# EAGLE design sensor_v60 (EAGLE 7.7.0)
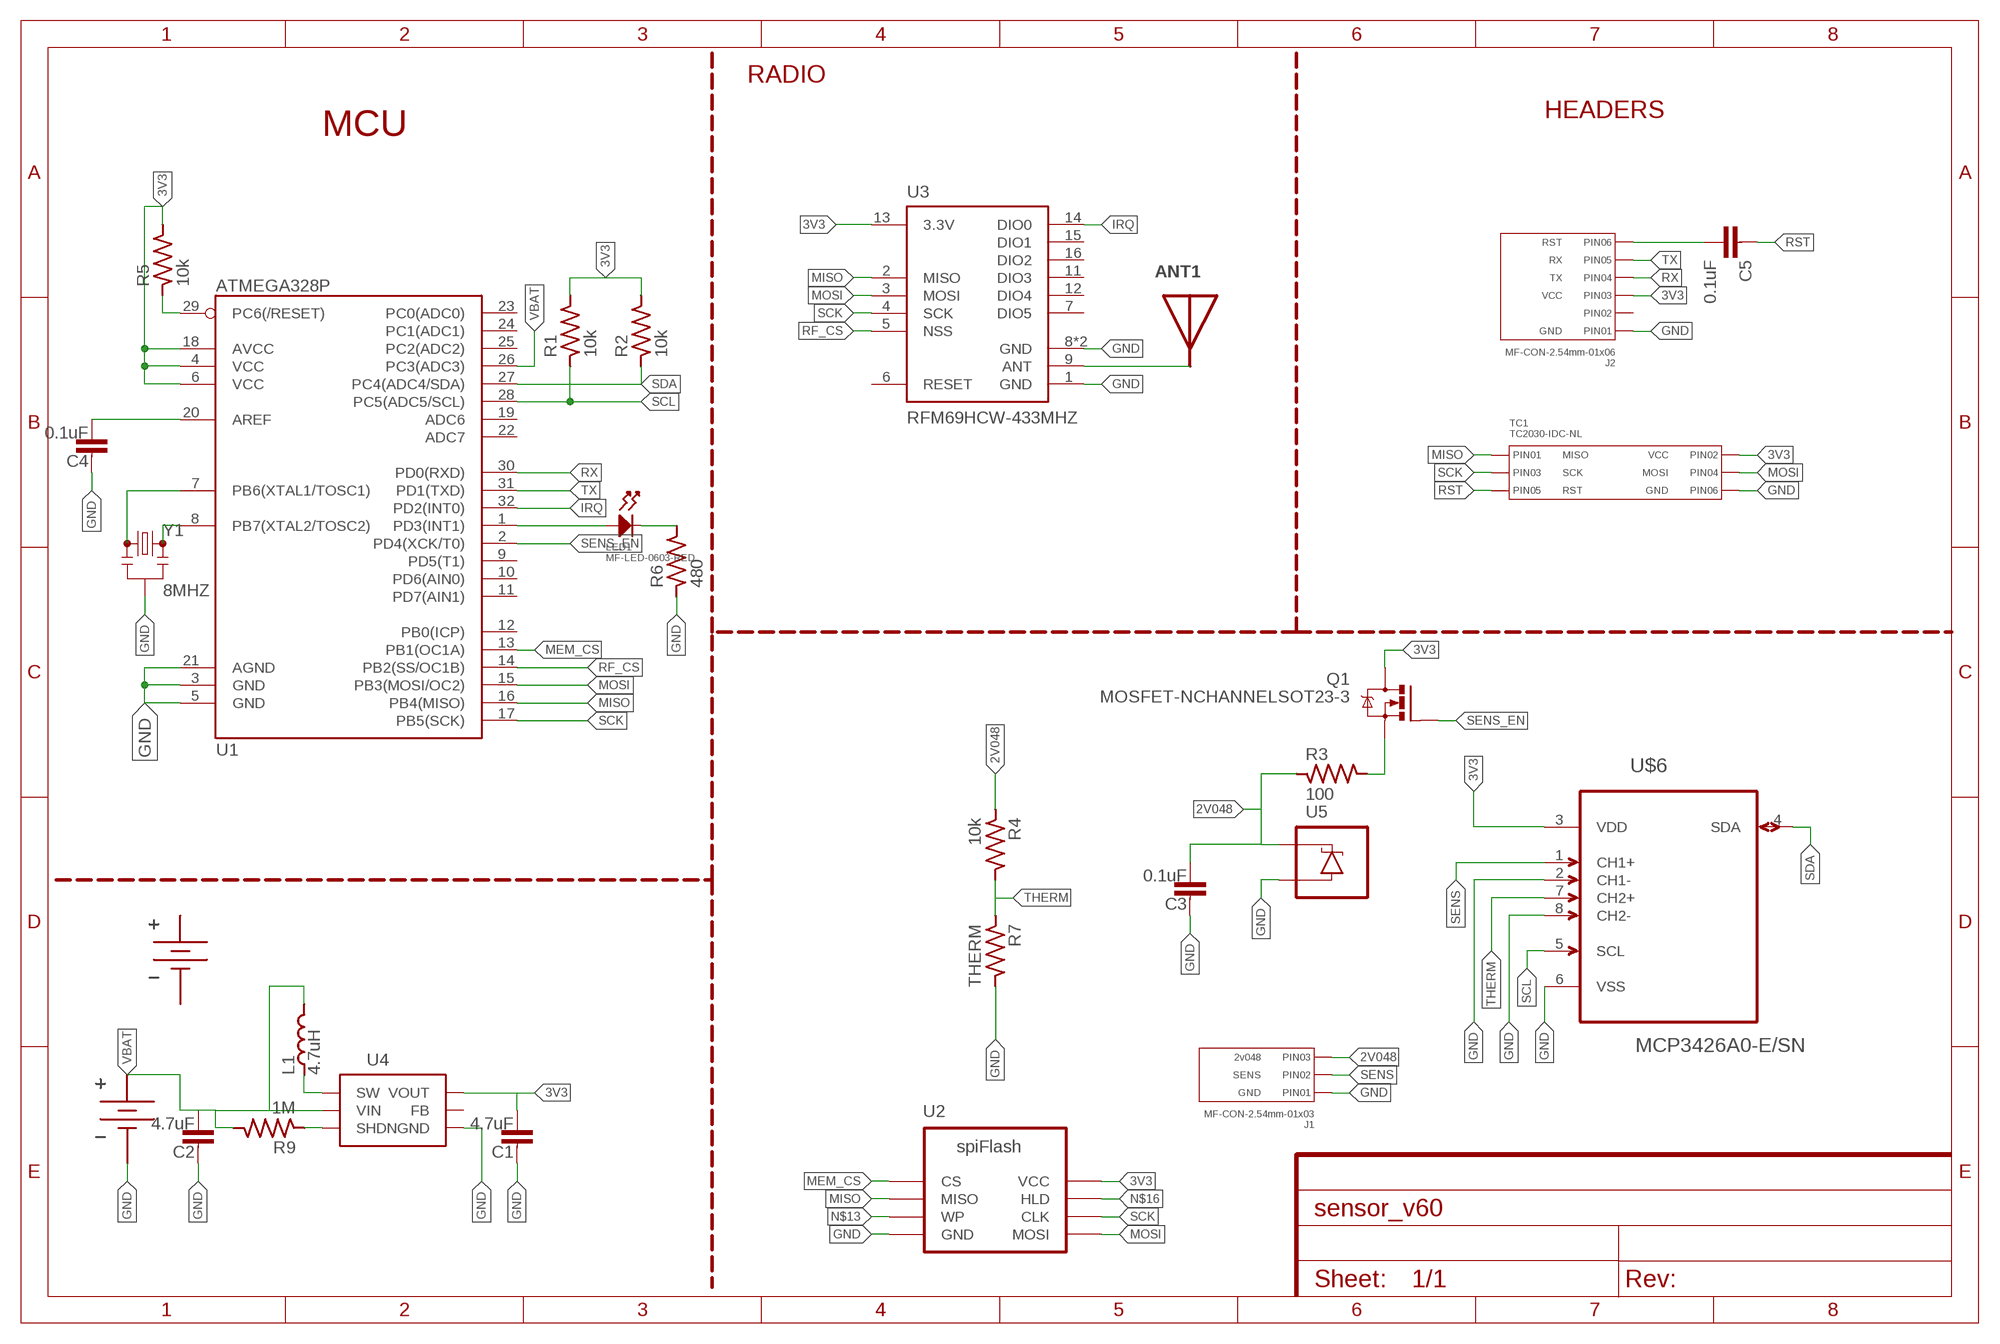
[diagram p0: schematic, sheet 1]

## Parts
ANT1  ANTENNA-433_CHIP  [ANT_433_CHIP]
BATT1  BATTERY_HOLDER-18650_CLIP  [BAT_18650_CLIP]
C1  4.7uF  CAPACITOR_NP0603-N  [C0603-N]
C2  4.7uF  CAPACITOR_NP0603-N  [C0603-N]
C3  0.1uF  CAPACITOR_NP0603-N  [C0603-N]
C4  0.1uF  CAPACITOR_NP0603-N  [C0603-N]
C5  0.1uF  CAPACITOR0603-N  [C0603-N]
J1  MF-CON-2.54mm-01x03  CON_01X03_PTH_2.54MM  [PTH_2.54MM_01X03]
J2  MF-CON-2.54mm-01x06  CON_01X06_PTH_2.54MM  [PTH_2.54MM_01X06]
L1  4.7uH  INDUCTOR3030  [L3030]
LED1  MF-LED-0603-RED  LED_SINGLE-0603-RED  [LED0603]
Q1  MOSFET-NCHANNELSOT23-3  [SOT23-3]
R1  10k  RESISTOR0603-N  [R0603-N]
R2  10k  RESISTOR0603-N  [R0603-N]
R3  100  RESISTOR0603-N  [R0603-N]
R4  10k  RESISTOR0603-N  [R0603-N]
R5  10k  RESISTOR0603-N  [R0603-N]
R6  480  RESISTOR0603-N  [R0603-N]
R7  THERM  RESISTOR0603-N  [R0603-N]
R9  1M  RESISTOR0603-N  [R0603-N]
TC1  TC2030-IDC-NL  CON_02X03_AVRISP_TC2030-IDC-NL  [TC2030-IDC-NL]
U1  ATMEGA328P  ATMEGA328P_SMD-AU  [TQFP32]
U2  WINBOND_FLASH_4MBIT-SOIC  [SOIC8]
U3  RFM69HCW-433MHZ  [RFM69HCW-XXXS2]
U4  AAT1217-SOT23-6  [SOT23-6]
U5  LM4040-SOT-23-3  [SOT23-3]
U$1  KEYSTONEAAHOLDER_2CELL  [KEYSTONEAAHOLDER_2CELL]
U$6  MCP3426A0-E/SN  [SOIC127P600X175-8N]
Y1  8MHZ  RESONATOR8MHZ  [RESONATOR-SMD]

## Nets
2V048: C3.2 J1.P$3(PIN3) R3.1 R4.1 U5.1(C)
3V3: C1.2 J2.P$3(PIN3) Q1.3(D) R1.2 R2.2 R5.2 TC1.P$2(PIN2) U1.4(VCC) U1.6(VCC) U1.18(AVCC) U2.8(VCC) U3.13(3.3V) U4.5(VOUT) U$6.3(VDD)
GND: C1.1 C2.1 C3.1 C4.1 J1.P$1(PIN1) J2.P$1(PIN1) R6.1 R7.2 TC1.P$6(PIN6) U1.3(GND) U1.5(GND) U1.21(AGND) U2.4(GND) U3.1(GND) U3.8(GND) U3.10(GND) U4.2(GND) U5.2(A) U$1.P$2(GND) U$6.2(CH1-) U$6.6(VSS) U$6.8(CH2-) Y1.2
IRQ: U1.32(PD2(INT0)) U3.14(DIO0)
MEM_CS: U1.13(PB1(OC1A)) U2.1(CS)
MISO: TC1.P$1(PIN1) U1.16(PB4(MISO)) U2.2(MISO) U3.2(MISO)
MOSI: TC1.P$4(PIN4) U1.15(PB3(MOSI/OC2)) U2.5(MOSI) U3.3(MOSI)
N$1: R9.1 U4.4(SHDN)
N$2: ANT1.1 U3.9(ANT)
N$3: LED1.ANODE U1.1(PD3(INT1))
N$4: C4.2 U1.20(AREF)
N$5: LED1.CATHODE R6.2
N$6: L1.P$1 U4.1(SW)
N$7: U1.7(PB6(XTAL1/TOSC1)) Y1.1
N$8: U1.8(PB7(XTAL2/TOSC2)) Y1.3
N$10: C5.2 J2.P$6(PIN6)
N$12: Q1.2(S) R3.2
N$13: U2.3(WP)
N$16: U2.7(HLD)
RF_CS: U1.14(PB2(SS/OC1B)) U3.5(NSS)
RST: C5.1 R5.1 TC1.P$5(PIN5) U1.29(PC6(/RESET))
RX: J2.P$4(PIN4) U1.30(PD0(RXD))
SCK: TC1.P$3(PIN3) U1.17(PB5(SCK)) U2.6(CLK) U3.4(SCK)
SCL: R1.1 U1.28(PC5(ADC5/SCL)) U$6.5(SCL)
SDA: R2.1 U1.27(PC4(ADC4/SDA)) U$6.4(SDA)
SENS: J1.P$2(PIN2) U$6.1(CH1+)
SENS_EN: Q1.1(G) U1.2(PD4(XCK/T0))
THERM: R4.2 R7.1 U$6.7(CH2+)
TX: J2.P$5(PIN5) U1.31(PD1(TXD))
VBAT: C2.2 L1.P$2 R9.2 U1.26(PC3(ADC3)) U4.6(VIN) U$1.P$1(VBAT)
Unconnected: BATT1.NEG_1(GND) BATT1.NEG_2(GND) BATT1.NEG_3(GND) BATT1.POS_1(VBAT) BATT1.POS_2(VBAT) BATT1.POS_3(VBAT) J2.P$2(PIN2) U1.9(PD5(T1)) U1.10(PD6(AIN0)) U1.11(PD7(AIN1)) U1.12(PB0(ICP)) U1.19(ADC6) U1.22(ADC7) U1.23(PC0(ADC0)) U1.24(PC1(ADC1)) U1.25(PC2(ADC2)) U3.6(RESET) U3.7(DIO5) U3.11(DIO3) U3.12(DIO4) U3.15(DIO1) U3.16(DIO2) U4.3(FB)

## Notes on the sheet
- RADIO
- HEADERS
- MCU

## Library data of the parts
ANT1 = My_RF:ANTENNA; PARTNO: 0433AT62A0020E
BATT1 = My_Connectors:BATTERY_HOLDER; NOTE: Parts x2!!; PARTNO: 54
C1-C4 = My_Passives:CAPACITOR_NP
C5 = passives-7351:CAPACITOR
J1 = My_Connectors:CON_01X03: Library: MF_Connectors Description: Header Connector with 03 Positions and 01 Rows. Use the LABEL Attribute to label the pin on the schematic and PCB. You can remove the attributes on the PCB by using the SMASH function on the part and then deleting the text.; HOUSEPART: YES; LABEL01: GND; LABEL02: SENS; LABEL03: 2v048; MPN: MF-CON-2.54mm-01x03; PARTNO: 0022053031; POPULATE: 1; URL: https://factory.macrofab.com/part/MF-CON-2.54mm-01x03
J2 = My_Connectors:CON_01X06: Library: MF_Connectors Description: Header Connector with 6 Positions and 01 Rows. Use the LABEL Attribute to label the pin on the schematic and PCB. You can remove the attributes on the PCB by using the SMASH function on the part and then deleting the text.; HOUSEPART: YES; LABEL01: GND; LABEL03: VCC; LABEL04: TX; LABEL05: RX; LABEL06: RST; MPN: MF-CON-2.54mm-01x06; POPULATE: 1; URL: https://factory.macrofab.com/part/MF-CON-2.54mm-01x06
L1 = My_Passives:INDUCTOR
LED1 = My_LEDs:LED_SINGLE: Library: MF_LEDs Description: Device for Single LED Packages. Manufacture part number (MFG#) can be added via Attributes.; HOUSEPART: YES; MPN: MF-LED-0603-RED; POPULATE: 1; URL: https://factory.macrofab.com/part/MF-LED-0603-RED
Q1 = My_Descrete_Semiconductors:MOSFET-NCHANNEL: Common NMOSFET Parts MFG P/N Store ID Prod ID FDD8780 TRANS-09984 SI7820DN TRANS-11055 FDS6630A IC-08089 2N7002PW TRANS-11151 FQP30N06L COM-10213 TRANS-10060 BSS123LT1G TRANS-08345 BSS138 TRANS-00830 BS170 2N7000
R1-R7 R9 = My_Passives:RESISTOR
TC1 = My_Connectors:CON_02X03: Library: MF_Connectors Description: Header Connector with 6 Positions and 02 Rows. Use the LABEL Attribute to label the pin on the schematic and PCB. You can remove the attributes on the PCB by using the SMASH function on the part and then deleting the text.; HOUSEPART: NO; LABEL01: MISO; LABEL02: VCC; LABEL03: SCK; LABEL04: MOSI; LABEL05: RST; LABEL06: GND; MPN: TC2030-IDC-NL; PARTNO: NA; POPULATE: 0; URL: http://www.tag-connect.com/AVRISP
U1 = My_IC_Digital:ATMEGA328P_SMD: Atmel 32-pin 8-bit micro 16k flash.
U2 = My_IC_Digital:WINBOND_FLASH_4MBIT
U3 = My_RF:RFM69H; PARTNO: COM-13910; PROD_ID: IC-11997, IC-12053
U4 = My_IC_Power:AAT1217; PARTNO: AAT1217ICA-3.3-T1
U5 = My_Descrete_Semiconductors:LM4040; PARTNO: LM4040AIM3-2.0/NOPB
U$1 = _my-parts:KEYSTONEAAHOLDER_2CELL
U$6 = Microchip_By_element14_Batch_1:MCP3426A0-E/SN: Analog-to-Digital Converter; MPN: MCP3426A0-E/SN; OC_FARNELL: 1825012; OC_NEWARK: 52R9954; PACKAGE: SOIC-8; SUPPLIER: Microchip
Y1 = My_xTal:RESONATOR: Resonator Small SMD resonator. Used, eg, on the Arduino Pro/ Pro Mini boards. 8MHz- XTAL-08895 16MHz- XTAL-08900; PARTNO: CSTCE8M00G55-R0; PROD_ID: XTAL-08895

## Board
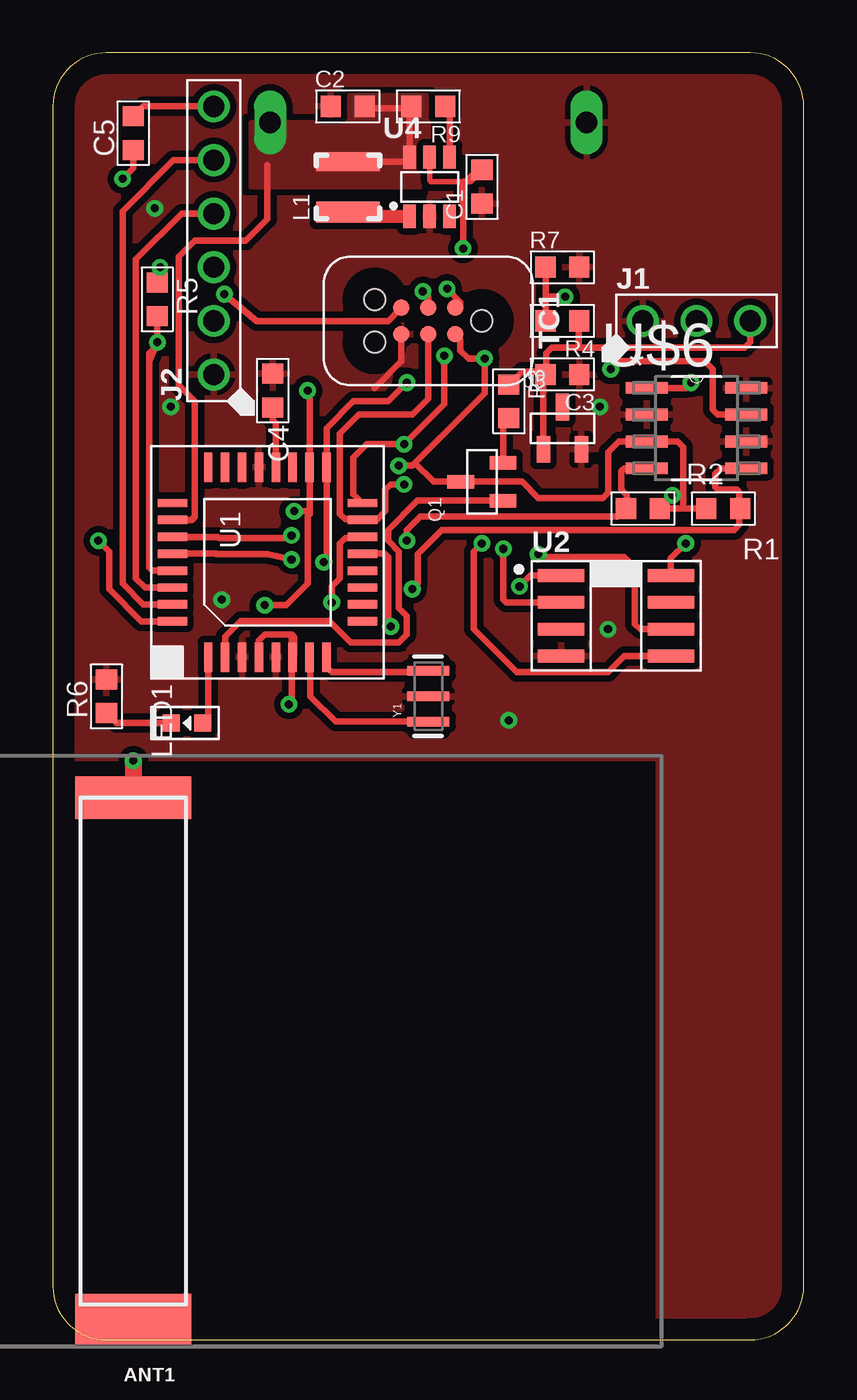
[diagram p1: board, top side]
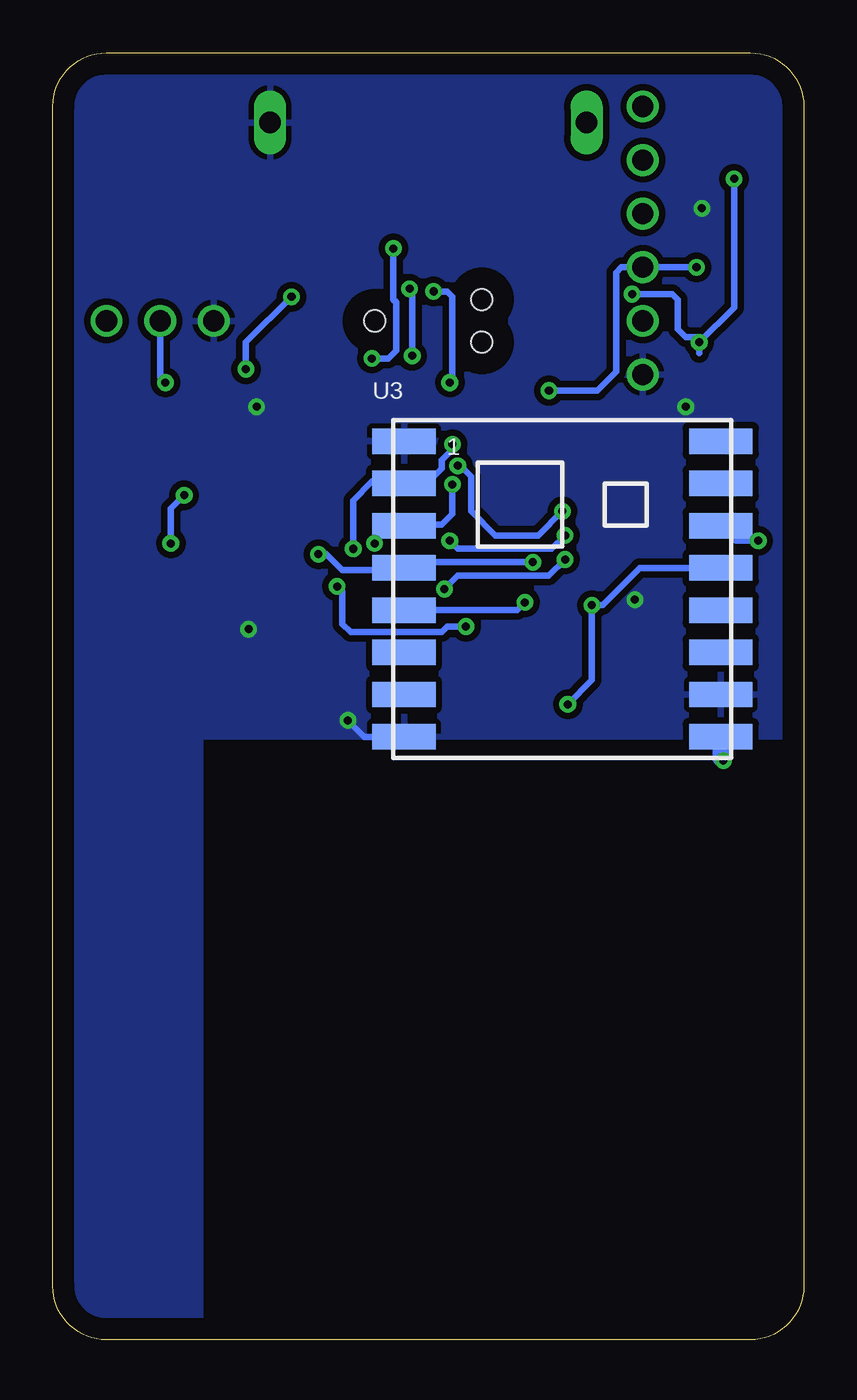
[diagram p2: board, bottom side, seen from below]

Size 35.56 x 60.96 mm. Coordinates in mm from the lower left corner, seen from the top.
Outline: 0,58.42 0,2.54 arc90 2.54,0 33.02,0 arc90 35.56,2.54 35.56,58.42 arc90 33.02,60.96 2.54,60.96 arc90 0,58.42
Copper layers (1*16): Top 0.035mm / dielectric 1.5mm / Bottom 0.035mm
Design rules "default": minimum track width 10mil, minimum drill 24mil, track to track 8mil, track to pad 8mil, pad to pad 8mil, via to via 8mil, smd to smd 8mil, copper to edge 40mil, drill to drill 8mil, minimum pad ring 10mil, minimum via ring 8mil, stop-mask expansion 4mil, vias tented up to drill 0mil, thermal gap 10mil

### Footprints (pad centres in the part's own frame; a part is rotated, then mirrored left to right if it is on the bottom)
ANT_433_CHIP = smd 5.5 x 2: 1 0,1 | smd 5.5 x 2.5: 2 0,25.75
BAT_18650_CLIP = drill 1.829 octagon: NEG_1 -7.62,0; NEG_2 0,2.54; NEG_3 0,-2.54; POS_1 48.006,2.54; POS_2 48.006,-2.54; POS_3 55.626,0
C0603-N = smd 0.95 x 1: 1 -0.8,0; 2 0.8,0
PTH_2.54MM_01X03 = drill 1: P$1 -2.54,0; P$2 0,0; P$3 2.54,0
PTH_2.54MM_01X06 = drill 1: P$1 -6.35,0; P$2 -3.81,0; P$3 -1.27,0; P$4 1.27,0; P$5 3.81,0; P$6 6.35,0
L3030 = smd 1 x 3: P$1 -1.2,0 | smd 0.9 x 3: P$2 1.2,0
LED0603 = smd 0.8 x 0.8: ANODE 0.75,0; CATHODE -0.75,0
SOT23-3 = smd 0.635 x 1.27: 1 -0.9,-1; 2 0.9,-1; 3 0,1
R0603-N = smd 0.95 x 1: 1 -0.8,0; 2 0.8,0
TC2030-IDC-NL = smd 0.787 x 0.787: P$1 -1.27,-0.635; P$2 -1.27,0.635; P$3 0,-0.635; P$4 0,0.635; P$5 1.27,-0.635; P$6 1.27,0.635 | hole 0.991: 2.54,1.016; 2.54,-1.016; -2.54,0
TQFP32 = smd 1.4 x 0.4: 1 -4.5,2.8; 2 -4.5,2; 3 -4.5,1.2; 4 -4.5,0.4; 5 -4.5,-0.4; 6 -4.5,-1.2; 7 -4.5,-2; 8 -4.5,-2.8; 17 4.5,-2.8; 18 4.5,-2; 19 4.5,-1.2; 20 4.5,-0.4; 21 4.5,0.4; 22 4.5,1.2; 23 4.5,2; 24 4.5,2.8 | smd 0.4 x 1.4: 9 -2.8,-4.5; 10 -2,-4.5; 11 -1.2,-4.5; 12 -0.4,-4.5; 13 0.4,-4.5; 14 1.2,-4.5; 15 2,-4.5; 16 2.8,-4.5; 25 2.8,4.5; 26 2,4.5; 27 1.2,4.5; 28 0.4,4.5; 29 -0.4,4.5; 30 -1.2,4.5; 31 -2,4.5; 32 -2.8,4.5
SOIC8 = smd 2.2 x 0.6: 1 -2.6,1.905; 2 -2.6,0.635; 3 -2.6,-0.635; 4 -2.6,-1.905; 5 2.6,-1.905; 6 2.6,-0.635; 7 2.6,0.635; 8 2.6,1.905
RFM69HCW-XXXS2 = smd 3 x 1.2: 1 -7.5,7; 2 -7.5,5; 3 -7.5,3; 4 -7.5,1; 5 -7.5,-1; 6 -7.5,-3; 7 -7.5,-5; 8 -7.5,-7; 9 7.5,-7; 10 7.5,-5; 11 7.5,-3; 12 7.5,-1; 13 7.5,1; 14 7.5,3; 15 7.5,5; 16 7.5,7
SOT23-6 = smd 0.6 x 1.1: 1 0,0; 2 0.95,0; 3 1.9,0; 4 1.9,2.8; 5 0.95,2.8; 6 0,2.8
KEYSTONEAAHOLDER_2CELL = drill 1.016 pad 1.524 long: P$1 -7.493,27.178; P$2 7.493,27.178
SOIC127P600X175-8N = smd 1.981 x 0.559: 1 -2.362,1.905; 2 -2.362,0.635; 3 -2.362,-0.635; 4 -2.362,-1.905; 5 2.362,-1.905; 6 2.362,-0.635; 7 2.362,0.635; 8 2.362,1.905
RESONATOR-SMD = smd 0.45 x 2: 1 -1.2,0; 2 0,0; 3 1.2,0

### Placement (x,y rotation side)
ANT1  3.81,26.67 180 top
BATT1  3.17,-19.05 0 top  (outside the outline)
C1  20.32,54.61 90 top
C2  13.97,58.42 0 top
C3  24.13,45.72 180 top
C4  10.41,44.96 270 top
C5  3.81,57.15 90 top
J1  30.48,48.26 0 top
J2  7.62,52.07 90 top
L1  13.97,54.61 90 top
LED1  6.35,29.21 0 top
Q1  20.32,40.64 90 top
R1  31.75,39.37 180 top
R2  27.94,39.37 0 top
R3  21.59,44.45 270 top
R4  24.13,48.26 180 top
R5  4.95,49.28 90 top
R6  2.54,30.48 270 top
R7  24.13,50.8 0 top
R9  17.78,58.42 180 top
TC1  17.78,48.26 180 top
U1  10.16,36.83 90 top
U2  26.67,34.29 0 top
U3  11.43,35.56 0 bottom
U4  16.89,53.21 0 top
U5  24.13,43.18 0 top
U$1  17.78,30.48 0 top
U$6  30.48,43.18 0 top
Y1  17.78,30.48 90 top

### Tracks (layer width: path | path; a pad name or v marks a point on that pad's centre or on a via)
2V048
  Top 0.305: R4.1 24.89,48.22 24.89,47.12 25.02,46.99 | J1.P$3 33.02,47.24 32.77,46.99 25.02,46.99 | 25.02,46.99 23.62,46.99 23.37,46.74 23.37,45.76 C3.2 | R3.1 21.63,45.25 22.23,45.85 23.2,45.85 C3.2 | U5.1 23.23,45.62 C3.2
3V3  (via drill 0.38)
  Top 0.254: U4.5 17.84,54.93 17.91,54.86 19.43,54.86 | 19.56,54.86 19.77,54.86 C1.2
  Top 0.305: 12.16,39.12 U1.18 12.16,44.86 v12.06,44.96 | U1.4 9.76,33.13 10.03,33.4 11.3,33.4 | 11.3,33.4 11.43,33.27 11.43,32.4 U1.6 | v11.43,39.24 12.03,39.24 12.16,39.12 | 11.3,33.4 11.3,30.23 v11.18,30.1 | 19.18,47.62 TC1.P$2 19.3,47.37 19.3,46.86 19.68,46.48 v20.45,46.48 20.45,44.83 17.14,41.53 | C1.2 20.36,55.37 20.07,55.37 19.56,54.86 19.43,54.86 v19.43,51.69 | R2.2 29.84,39.37 | 29.84,39.37 R1.2 | 29.84,40.01 29.84,42.29 29.59,42.55 U$6.3 26.8,42.55 26.29,42.04 26.29,40.13 26.04,39.88 22.99,39.88 22.23,40.64 19.81,40.64 19.81,40.77 19.68,40.64 Q1.3 18.03,40.64 17.14,41.53 | 29.84,40.01 29.84,39.37 | v16.38,41.4 17.02,41.4 17.14,41.53 | v10.03,34.8 11.05,34.8 12.06,35.81 12.06,39.02 12.16,39.12 | U2.8 29.27,37.02 v29.97,37.72 | v29.34,40.01 29.84,40.01 | v5.08,50.8 5.08,50.2 R5.2
  Bottom 0.305: v12.06,44.96 9.78,44.96 8.89,45.85 8.89,50.55 8.64,50.8 J2.P$3 v5.08,50.8 | v20.45,46.48 19.68,46.48 19.3,46.86 19.3,49.15 19.43,49.28 v19.43,51.69 | v11.18,30.1 10.03,31.24 v10.03,34.8 9.53,34.8 7.76,36.56 U3.13 | v16.38,41.4 16.26,41.4 15.75,40.89 15.75,39.24 14.61,38.1 12.57,38.1 v11.43,39.24 | v29.97,37.72 29.97,39.37 v29.34,40.01
GND  (via drill 0.38)
  Top 0.305: TC1.P$6 16.51,46.35 15.24,45.09
  Bottom 0.305: U3.8 20.81,28.56 v21.59,29.34
  other vias: 8,35.05 26.29,33.66 5.59,44.2 4.83,53.59 25.91,44.2
  pour Top (isolate 0.305, rank 6): -2.54,27.56 28.7,27.56 28.7,0 38.1,0 38.1,63.5 -2.54,63.5
  pour Bottom (isolate 0.305): -3.17,28.57 28.57,28.57 28.57,0 38.1,0 38.1,63.5 -6.35,63.5 -6.35,28.57
IRQ  (via drill 0.38)
  Top 0.305: v2.16,37.85 2.67,37.34 2.67,35.56 4.2,34.03 U1.32
  Bottom 0.305: 3.88,38.61 U3.14 3.22,37.85 v2.16,37.85
MEM_CS  (via drill 0.38)
  Top 0.305: U1.13 15.73,37.23 15.88,37.08 15.88,33.91 v16,33.78 | v22.1,35.69 22.61,36.2 U2.1
  Bottom 0.305: v16,33.78 16.89,33.78 17.14,33.53 21.46,33.53 21.84,33.91 21.84,35.43 v22.1,35.69
MISO  (via drill 0.38)
  Top 0.305: TC1.P$1 19.3,48.9 19.3,49.15 v18.67,49.78 | U1.16 14.22,40.07 14.22,41.78 14.86,42.42 v16.64,42.42 18.54,44.32 v18.54,46.61 | U2.2 21.46,34.92 21.34,35.05 v21.34,37.47
  Bottom 0.305: v18.54,46.61 18.54,49.66 v18.67,49.78 | v16.64,42.42 16.64,42.16 17.14,41.66 17.14,41.27 17.86,40.56 U3.2 19.01,40.64 20.45,40.64 21.34,39.75 v21.34,37.47
MOSI  (via drill 0.38)
  Top 0.305: TC1.P$4 17.78,44.58 17.02,43.81 14.48,43.81 13.59,42.93 13.59,39.12 13.84,38.86 14.63,38.86 U1.15 15.34,38.83 15.75,39.24 15.75,40.26 16,40.51 v16.64,40.51 | v20.32,37.72 19.94,37.34 19.94,33.66 21.97,31.62 26.29,31.62 27.05,32.38 U2.5
  Bottom 0.305: 18.75,38.73 U3.3 | 18.85,38.48 U3.3 | v16.64,40.51 16.64,39.12 17.14,38.61 18.88,38.61 U3.3 | v20.32,37.72 20.32,37.85 19.68,38.48 19.01,38.48 U3.3
N$1
  Top 0.305: U4.4 18.79,56.89 18.8,56.9 18.8,58.2 R9.1
N$2  (via drill 0.38)
  Top 0.813: v3.81,27.43 ANT1.1
  Bottom 0.305: 3.93,27.55 v3.81,27.43
  Bottom 0.813: U3.9 3.93,27.55
N$3
  Top 0.305: U1.1 7.36,29.47 LED1.ANODE
N$4
  Top 0.305: U1.20 10.56,43.41 10.41,43.56 C4.2
N$5
  Top 0.305: LED1.CATHODE 3.01,29.21 R6.2
N$6
  Top 0.254: L1.P$1 14.17,53.21
  Top 0.61: 14.17,53.21 U4.1
N$7
  Top 0.305: Y1.1 13.39,29.28 12.19,30.48 12.19,32.3 U1.7
N$8
  Top 0.305: Y1.3 17.72,31.62 13.21,31.62 12.96,31.87 U1.8
N$10
  Top 0.305: J2.P$6 4.28,58.42 C5.2
N$12
  Top 0.305: Q1.2 21.32,43.38 R3.2
RF_CS  (via drill 0.38)
  Top 0.305: v13.21,34.92 13.21,35.69 13.59,36.07 13.59,37.72 13.84,37.97 14.6,37.97 U1.14
  Bottom 0.305: U3.5 13.57,34.56 v13.21,34.92
RST  (via drill 0.38)
  Top 0.305: TC1.P$5 15.88,48.26 9.65,48.26 v8.13,49.53 | U1.29 4.72,36.43 4.57,36.58 4.57,46.35 | 4.57,46.35 4.57,46.74 4.95,47.12 R5.1 | v4.95,47.24 4.57,46.35 | C5.1 3.81,55.5 v3.3,54.99
  Bottom 0.305: v8.13,49.53 6.22,49.53 5.97,49.28 5.97,47.88 5.59,47.5 4.95,47.5 v4.95,47.24 | 4.95,46.74 v4.95,47.24 | v3.3,54.99 3.3,48.9 v4.95,47.24
RX
  Top 0.305: U1.30 4.38,35.63 3.94,36.07 3.94,51.18 6.1,53.34 J2.P$4
SCK  (via drill 0.38)
  Top 0.305: v12.83,36.83 12.96,36.71 U1.17 12.96,43.19 14.22,44.45 15.88,44.45 v16.76,45.34 | TC1.P$3 17.78,49.4 v17.53,49.66 | U2.6 27.81,33.66 27.56,33.91 27.56,36.58 27.05,37.08 23.11,37.08 v22.99,37.21
  Bottom 0.305: 18.91,36.58 U3.4 | v17.53,49.66 16.89,49.66 16.64,49.4 16.64,45.47 v16.76,45.34 | v12.83,36.83 18.66,36.83 U3.4 | v22.99,37.21 22.61,37.21 21.84,36.45 19.04,36.45 U3.4
SCL  (via drill 0.38)
  Top 0.305: U1.28 7.73,37.23 7.75,37.21 10.16,37.21 v11.3,36.96 | U$6.5 31.62,41.27 31.37,41.02 31.37,40.39 31.5,40.26 32.38,40.26 32.51,40.13 32.51,39.41 R1.1 32.51,39.33 32.51,38.61 32.26,38.35 18.41,38.35 17.27,37.21 17.27,35.81 v17.02,35.56
  Bottom 0.305: v11.3,36.96 12.06,36.2 16.38,36.2 v17.02,35.56
SDA  (via drill 0.38)
  Top 0.305: U1.27 7.82,38.03 7.87,37.97 11.18,37.97 v11.3,38.1 | U$6.4 27.05,41.27 26.92,41.15 26.92,40.26 27.18,40.01 27.18,39.41 R2.1 | 27.05,39.28 R2.1 | v16.76,37.85 16.76,38.35 17.4,38.99 26.76,38.99 R2.1
  Bottom 0.305: v11.3,38.1 11.94,37.47 16.38,37.47 v16.76,37.85
SENS  (via drill 0.38)
  Top 0.305: U$6.1 29.97,45.09 v30.23,45.34
  Bottom 0.305: J1.P$2 30.48,45.59 v30.23,45.34
SENS_EN
  Top 0.305: U1.2 8.16,33.31 8.89,34.04 13.08,34.04 14.1,33.02 16.38,33.02 16.76,33.4 16.76,34.29 16.38,34.67 16.38,37.34 15.88,37.85 15.88,38.35 17.26,39.74 Q1.1
THERM  (via drill 0.38)
  Top 0.305: R7.1 R4.2 23.33,49.37 23.37,49.4 v24.26,49.4 | U$6.7 31.5,43.81 31.24,44.07 31.24,45.97 30.86,46.35 26.67,46.35 26.42,46.1 v26.42,45.97
  Bottom 0.305: v24.26,49.4 26.42,47.24 v26.42,45.97
TX
  Top 0.305: J2.P$5 5.71,55.88 3.3,53.47 3.3,35.81 4.29,34.83 U1.31
VBAT
  Top 0.305: 16.89,58.33 U4.6 16.69,55.81 L1.P$2 | 16.89,58.33 R9.2 | 16.89,58.33 14.86,58.33 C2.2 | 10.16,55.63 10.16,53.09 9.14,52.07 6.73,52.07 5.97,51.31 5.97,45.21 6.73,44.45 6.73,38.99 6.57,38.83 U1.26
  pour Top (isolate 0.305, no thermals): 13.97,58.93 13.97,57.66 9.4,57.66 9.4,54.61 17.4,54.61 17.4,56.39 17.78,56.39 17.78,58.93